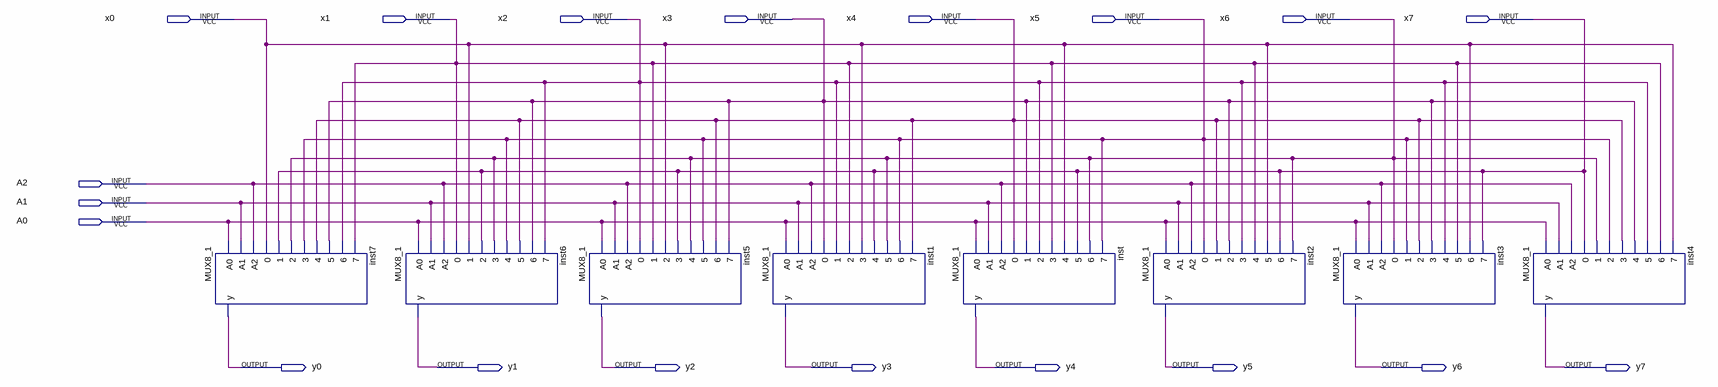
[diagram p0: schematic sheet]
// Quartus schematic Barrel_shifter.bdf as structural Verilog: 8 symbols, 19 pins
module Barrel_shifter (
  input  x0,
  input  x1,
  input  x2,
  input  x3,
  input  x4,
  input  x5,
  input  x6,
  input  x7,
  input  A2,
  input  A1,
  input  A0,
  output y0,
  output y1,
  output y2,
  output y3,
  output y4,
  output y5,
  output y6,
  output y7
);

  MUX8_1 inst7 (
    .A0(A0), .A1(A1), .A2(A2), .\0 (x0), .\1 (x7), .\2 (x6), .\3 (x5), .\4 (x4), .\5 (x3), .\6 (x2),
    .\7 (x1), .y(y0));
  MUX8_1 inst6 (
    .A0(A0), .A1(A1), .A2(A2), .\0 (x1), .\1 (x0), .\2 (x7), .\3 (x6), .\4 (x5), .\5 (x4), .\6 (x3),
    .\7 (x2), .y(y1));
  MUX8_1 inst5 (
    .A0(A0), .A1(A1), .A2(A2), .\0 (x2), .\1 (x1), .\2 (x0), .\3 (x7), .\4 (x6), .\5 (x5), .\6 (x4),
    .\7 (x3), .y(y2));
  MUX8_1 inst1 (
    .A0(A0), .A1(A1), .A2(A2), .\0 (x3), .\1 (x2), .\2 (x1), .\3 (x0), .\4 (x7), .\5 (x6), .\6 (x5),
    .\7 (x4), .y(y3));
  MUX8_1 inst (
    .A0(A0), .A1(A1), .A2(A2), .\0 (x4), .\1 (x3), .\2 (x2), .\3 (x1), .\4 (x0), .\5 (x7), .\6 (x6),
    .\7 (x5), .y(y4));
  MUX8_1 inst2 (
    .A0(A0), .A1(A1), .A2(A2), .\0 (x5), .\1 (x4), .\2 (x3), .\3 (x2), .\4 (x1), .\5 (x0), .\6 (x7),
    .\7 (x6), .y(y5));
  MUX8_1 inst3 (
    .A0(A0), .A1(A1), .A2(A2), .\0 (x6), .\1 (x5), .\2 (x4), .\3 (x3), .\4 (x2), .\5 (x1), .\6 (x0),
    .\7 (x7), .y(y6));
  MUX8_1 inst4 (
    .A0(A0), .A1(A1), .A2(A2), .\0 (x7), .\1 (x6), .\2 (x5), .\3 (x4), .\4 (x3), .\5 (x2), .\6 (x1),
    .\7 (x0), .y(y7));
endmodule
